# EAGLE design jayday_fez40 (EAGLE 6.3)
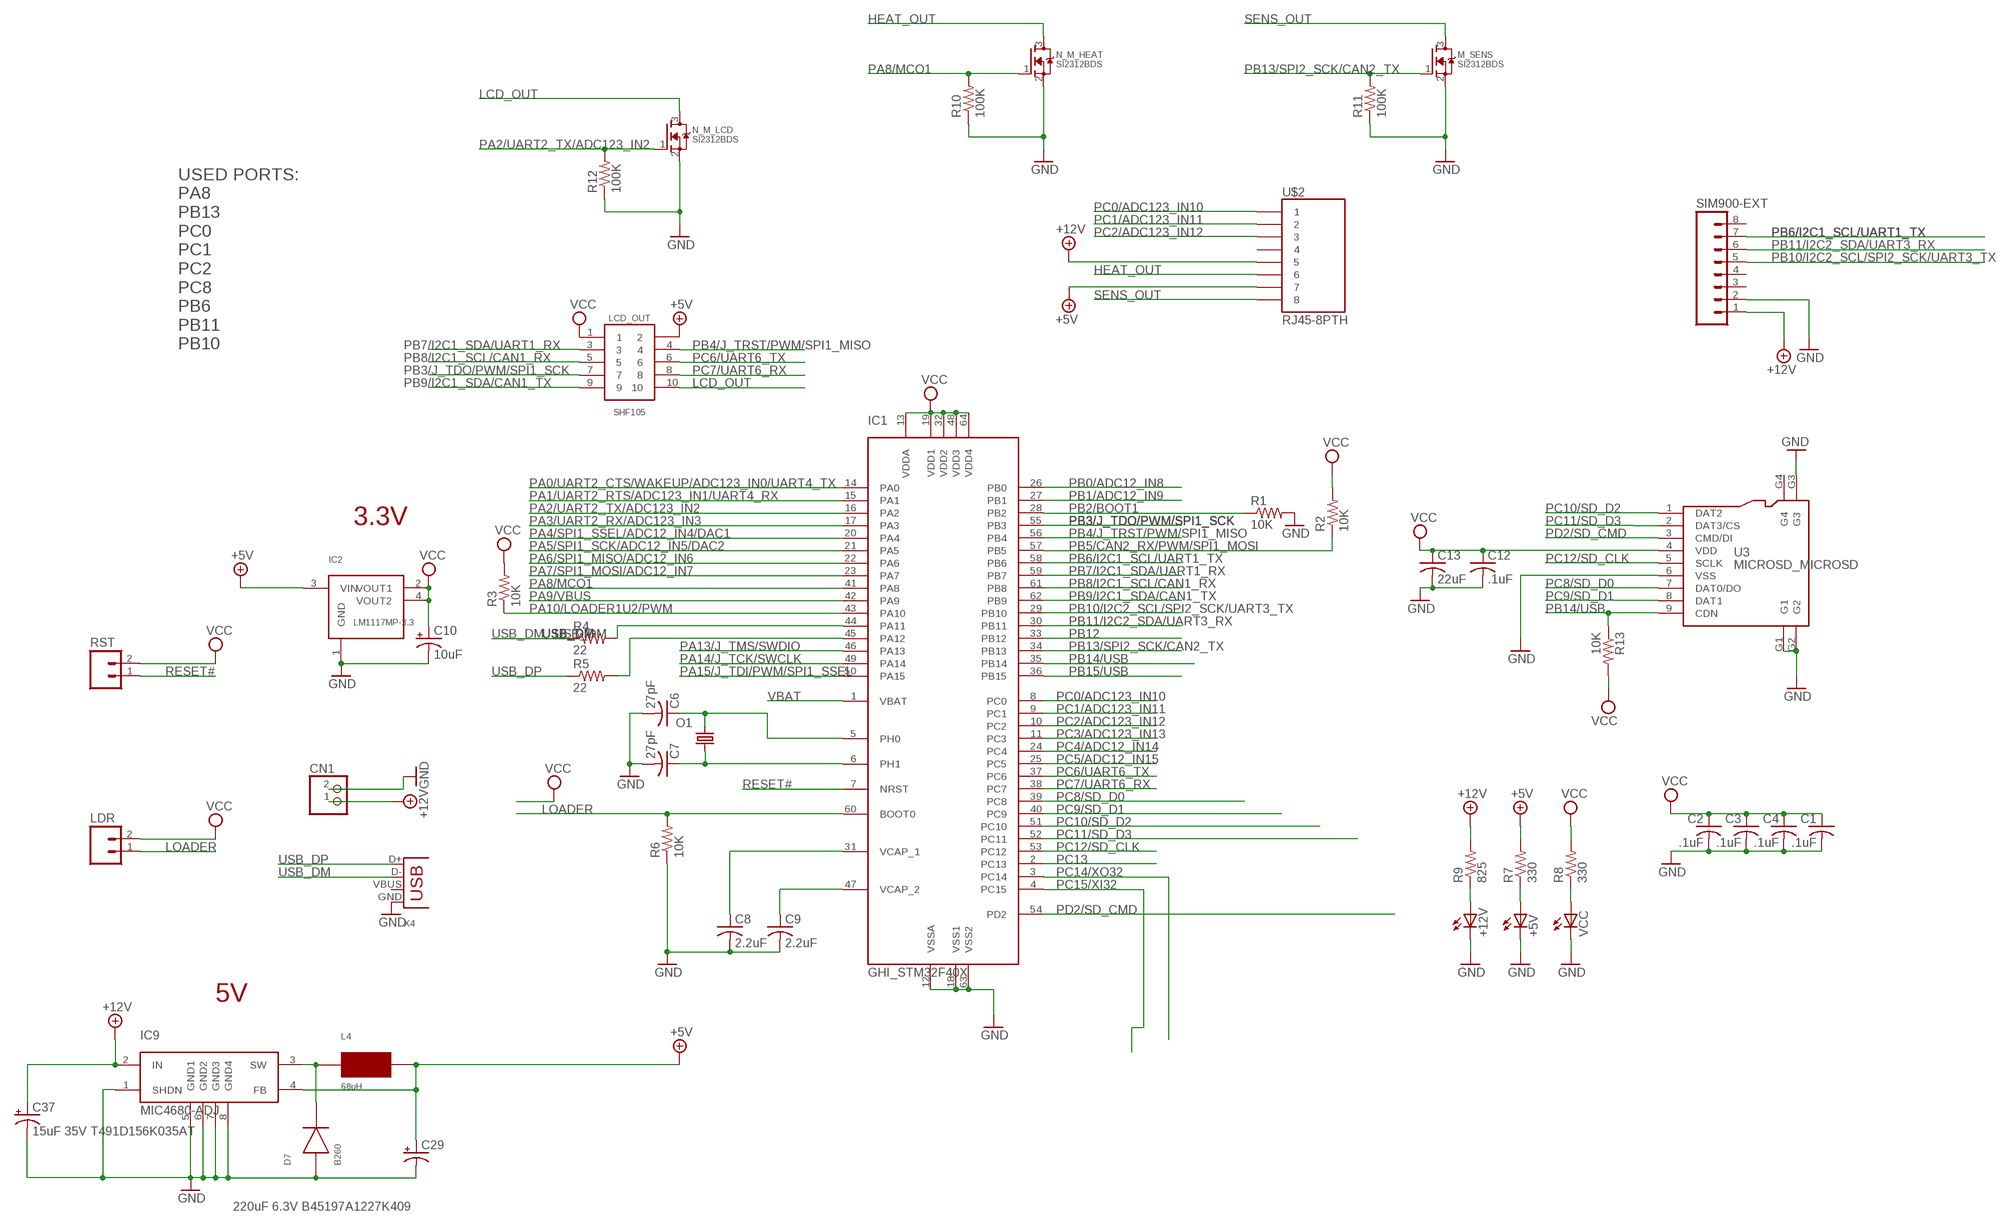
[diagram p0: schematic, sheet 1]

## Parts
+5V  LEDCHIPLED_0805  [CHIPLED_0805]
+12V  LEDCHIPLED_0805  [CHIPLED_0805]
C1  .1uF  C-USC0603K  [C0603K]
C2  .1uF  C-USC0603K  [C0603K]
C3  .1uF  C-USC0603K  [C0603K]
C4  .1uF  C-USC0603K  [C0603K]
C6  27pF  C-USC0603K  [C0603K]
C7  27pF  C-USC0603K  [C0603K]
C8  2.2uF  C-USC0805K  [C0805K]
C9  2.2uF  C-USC0805K  [C0805K]
C10  10uF  CPOL-USCT3528  [CT3528]
C12  .1uF  C-USC0603K  [C0603K]
C13  22uF  C-USC0805K  [C0805K]
C29  220uF 6.3V B45197A1227K409  CPOL-USD/7343-31W  [D/7343-31W]
C37  15uF 35V T491D156K035AT  CPOL-USD/7343-31W  [D/7343-31W]
CN1  JST_2PIN-THM-RA  [JST-PH-2-THM-RA]
D7  B260  DIODE_SMA  [DIODE_SMA]
IC1  GHI_STM32F40X  [GHI_LQFP64]
IC2  LM1117MP-3.3  LM1117  [SOT223]
IC9  MIC4680-ADJ  MIC4680  [SO8]
L4  68uH  UP2BXXX  [UP2BXXX]
LCD_OUT  SHF105  [GAD_PAC_SMD]
LDR  M02PTH  [1X02]
M_SENS  SI2312BDS  [TO-236]
N_M_HEAT  SI2312BDS  [TO-236]
N_M_LCD  SI2312BDS  [TO-236]
O1  12Mhz  CRYTALSM49  [SM49@1]
R1  10K  R-US_R0603  [R0603]
R2  10K  R-US_R0603  [R0603]
R3  10K  R-US_R0603  [R0603]
R4  22  R-US_R0603  [R0603]
R5  22  R-US_R0603  [R0603]
R6  10K  R-US_R0603  [R0603]
R7  330  R-US_R0603  [R0603]
R8  330  R-US_R0603  [R0603]
R9  825  R-US_R0603  [R0603]
R10  100K  R-US_R0603  [R0603]
R11  100K  R-US_R0603  [R0603]
R12  100K  R-US_R0603  [R0603]
R13  10K  R-US_R0603  [R0603]
RST  M02PTH  [1X02]
SIM900-EXT  M081X08  [1X08]
U3  MICROSD_MICROSD  [MICROSD_MICROSD]
U$2  RJ45-8PTH  [RJ45-8]
VCC  LEDCHIPLED_0805  [CHIPLED_0805]
X4  DX2R005HN2E700  USB-MB-S  [USB-MB-S]

## Nets
+5V: C29.+ IC2.3(VIN) IC9.4(FB) L4.P$2 LCD_OUT.2 R7.2 U$2.7
+12V: C37.+ CN1.1 IC9.2(IN) R9.2 SIM900-EXT.1 U$2.5
GND: +5V.C +12V.C C1.2 C2.2 C3.2 C4.2 C6.2 C7.2 C8.2 C9.2 C10.- C12.2 C13.2 C29.- C37.- CN1.2 D7.A IC1.12(VSSA) IC1.18(VSS1) IC1.63(VSS2) IC2.1(GND) IC9.1(SHDN) IC9.5(GND1) IC9.6(GND2) IC9.7(GND3) IC9.8(GND4) M_SENS.2(S) N_M_HEAT.2(S) N_M_LCD.2(S) R1.2 R6.1 R10.1 R11.1 R12.1 SIM900-EXT.2 U3.6(VSS) U3.G1 U3.G2 U3.G3 VCC.C X4.GND
HEAT_OUT: N_M_HEAT.3(D) U$2.6
LCD_OUT: LCD_OUT.10 N_M_LCD.3(D)
LOADER: IC1.60(BOOT0) LDR.1 R6.2
N$2: C9.1 IC1.47(VCAP_2)
N$3: C8.1 IC1.31(VCAP_1)
N$5: IC1.44(PA11) R4.2
N$7: IC1.45(PA12) R5.2
N$10: D7.K IC9.3(SW) L4.P$1
N$11: +5V.A R7.1
N$12: R8.1 VCC.A
N$13: +12V.A R9.1
PA0/UART2_CTS/WAKEUP/ADC123_IN0/UART4_TX: IC1.14(PA0)
PA1/UART2_RTS/ADC123_IN1/UART4_RX: IC1.15(PA1)
PA2/UART2_TX/ADC123_IN2: IC1.16(PA2) N_M_LCD.1(G) R12.2
PA3/UART2_RX/ADC123_IN3: IC1.17(PA3)
PA4/SPI1_SSEL/ADC12_IN4/DAC1: IC1.20(PA4)
PA5/SPI1_SCK/ADC12_IN5/DAC2: IC1.21(PA5)
PA6/SPI1_MISO/ADC12_IN6: IC1.22(PA6)
PA7/SPI1_MOSI/ADC12_IN7: IC1.23(PA7)
PA8/MCO1: IC1.41(PA8) N_M_HEAT.1(G) R10.2
PA9/VBUS: IC1.42(PA9)
PA10/LOADER1U2/PWM: IC1.43(PA10) R3.1
PA13/J_TMS/SWDIO: IC1.46(PA13)
PA14/J_TCK/SWCLK: IC1.49(PA14)
PA15/J_TDI/PWM/SPI1_SSEL: IC1.50(PA15)
PB0/ADC12_IN8: IC1.26(PB0)
PB1/ADC12_IN9: IC1.27(PB1)
PB2/BOOT1: IC1.28(PB2) R1.1
PB3/J_TDO/PWM/SPI1_SCK: IC1.55(PB3) LCD_OUT.7
PB4/J_TRST/PWM/SPI1_MISO: IC1.56(PB4) LCD_OUT.4
PB5/CAN2_RX/PWM/SPI1_MOSI: IC1.57(PB5) R2.1
PB6/I2C1_SCL/UART1_TX: IC1.58(PB6) SIM900-EXT.7
PB7/I2C1_SDA/UART1_RX: IC1.59(PB7) LCD_OUT.3
PB8/I2C1_SCL/CAN1_RX: IC1.61(PB8) LCD_OUT.5
PB9/I2C1_SDA/CAN1_TX: IC1.62(PB9) LCD_OUT.9
PB10/I2C2_SCL/SPI2_SCK/UART3_TX: IC1.29(PB10) SIM900-EXT.5
PB11/I2C2_SDA/UART3_RX: IC1.30(PB11) SIM900-EXT.6
PB12: IC1.33(PB12)
PB13/SPI2_SCK/CAN2_TX: IC1.34(PB13) M_SENS.1(G) R11.2
PB14/USB: IC1.35(PB14) R13.1 U3.9(CDN)
PB15/USB: IC1.36(PB15)
PC0/ADC123_IN10: IC1.8(PC0) U$2.1
PC1/ADC123_IN11: IC1.9(PC1) U$2.2
PC2/ADC123_IN12: IC1.10(PC2) U$2.3
PC3/ADC123_IN13: IC1.11(PC3)
PC4/ADC12_IN14: IC1.24(PC4)
PC5/ADC12_IN15: IC1.25(PC5)
PC6/UART6_TX: IC1.37(PC6) LCD_OUT.6
PC7/UART6_RX: IC1.38(PC7) LCD_OUT.8
PC8/SD_D0: IC1.39(PC8) U3.7(DAT0/DO)
PC9/SD_D1: IC1.40(PC9) U3.8(DAT1)
PC10/SD_D2: IC1.51(PC10) U3.1(DAT2)
PC11/SD_D3: IC1.52(PC11) U3.2(DAT3/CS)
PC12/SD_CLK: IC1.53(PC12) U3.5(SCLK)
PC13: IC1.2(PC13)
PC14/XO32: IC1.3(PC14)
PC15/XI32: IC1.4(PC15)
PD2/SD_CMD: IC1.54(PD2) U3.3(CMD/DI)
RESET#: IC1.7(NRST) RST.1
SENS_OUT: M_SENS.3(D) U$2.8
USB_DM: R4.1 X4.D-
USB_DP: R5.1 X4.D+
VBAT: IC1.1(VBAT)
VCC: C1.1 C2.1 C3.1 C4.1 C10.+ C12.1 C13.1 IC1.13(VDDA) IC1.19(VDD1) IC1.32(VDD2) IC1.48(VDD3) IC1.64(VDD4) IC2.2(VOUT1) IC2.4(VOUT2) LCD_OUT.1 LDR.2 R2.2 R3.2 R8.2 R13.2 RST.2 U3.4(VDD)
XTAL3: C6.1 IC1.5(PH0) O1.2
XTAL4: C7.1 IC1.6(PH1) O1.1
Unconnected: SIM900-EXT.3 SIM900-EXT.4 SIM900-EXT.8 U3.G4 U$2.4 X4.VBUS

## Notes on the sheet
- USED PORTS:
  PA8
  PB13
  PC0
  PC1
  PC2
  PC8
  PB6
  PB11
  PB10
- 3.3V
- 5V

## Library data of the parts
+5V +12V VCC = led:LED: LED OSRAM: - CHIPLED LG R971, LG N971, LY N971, LG Q971, LY Q971, LO R971, LY R971 LH N974, LH R974 LS Q976, LO Q976, LY Q976 LO Q996 - Hyper CHIPLED LW Q18S LB Q993, LB Q99A, LB R99A - SideLED LS A670, LO A670, LY A670, LG A670, LP A670 LB A673, LV A673, LT A673, LW A673 LH A674 LY A675 LS A676, LA A676, LO A676, LY A676, LW A676 LS A679, LY A679, LG A679 - Hyper Micro SIDELED® LS Y876, LA Y876, LO Y876, LY Y876 LT Y87S - SmartLED LW L88C, LW L88S LB L89C, LB L89S, LG L890 LS L89K, LO L89K, LY L89K LS L896, LA L896, LO L896, LY L896 - TOPLED LS T670, LO T670, LY T670, LG T670, LP T670 LSG T670, LSP T670, LSY T670, LOP T670, LYG T670 LG T671, LOG T671, LSG T671 LB T673, LV T673, LT T673, LW T673 LH T674 LS T676, LA T676, LO T676, LY T676, LB T676, LH T676, LSB T676, LW T676 LB T67C, LV T67C, LT T67C, LS T67K, LO T67K, LY T67K, LW E67C LS E67B, LA E67B, LO E67B, LY E67B, LB E67C, LV E67C, LT E67C LW T67C LS T679, LY T679, LG T679 LS T770, LO T770, LY T770, LG T770, LP T770 LB T773, LV T773, LT T773, LW T773 LH T774 LS E675, LA E675, LY E675, LS T675 LS T776, LA T776, LO T776, LY T776, LB T776 LHGB T686 LT T68C, LB T68C - Hyper Mini TOPLED® LB M676 - Mini TOPLED Santana® LG M470 LS M47K, LO M47K, LY M47K Source: http://www.osram.convergy.de LUXEON: - LUMILED® LXK2-PW12-R00, LXK2-PW12-S00, LXK2-PW14-U00, LXK2-PW14-V00 LXK2-PM12-R00, LXK2-PM12-S00, LXK2-PM14-U00 LXK2-PE12-Q00, LXK2-PE12-R00, LXK2-PE12-S00, LXK2-PE14-T00, LXK2-PE14-U00 LXK2-PB12-K00, LXK2-PB12-L00, LXK2-PB12-M00, LXK2-PB14-N00, LXK2-PB14-P00, LXK2-PB14-Q00 LXK2-PR12-L00, LXK2-PR12-M00, LXK2-PR14-Q00, LXK2-PR14-R00 LXK2-PD12-Q00, LXK2-PD12-R00, LXK2-PD12-S00 LXK2-PH12-R00, LXK2-PH12-S00 LXK2-PL12-P00, LXK2-PL12-Q00, LXK2-PL12-R00 Source: www.luxeon.com KINGBRIGHT: KA-3528ASYC Source: www.kingbright.com
C1-C4 C6-C9 C12 C13 = rcl:C-US: CAPACITOR, American symbol
C10 C29 C37 = rcl:CPOL-US: POLARIZED CAPACITOR, American symbol
CN1 = adafruit:JST_2PIN: JST 2-Pin Connectors of various flavors SMT-RA (S2B-PH-SM4) 4UConnector #17311 SMT (B2B-PH-SM4) THM-RA (S2B-PH) THM (B2B-PH)
D7 = GHI:DIODE_SMA
IC1 = FEZ_Cerb40:GHI_STM32F40X
IC2 = GHI:LM1117
IC9 = GHI:MIC4680
L4 = GHI:UP2BXXX
LCD_OUT = ozlollc:SHF105
LDR RST = SparkFun-Connectors:M02: Header 2 Standard 2-pin 0.1" header. Use with straight break away headers (SKU : PRT-00116), right angle break away headers (PRT-00553), swiss pins (PRT-00743), machine pins (PRT-00117), and female headers (PRT-00115). Molex polarized connector foot print use with SKU : PRT-08233 with associated crimp pins and housings.
M_SENS N_M_HEAT N_M_LCD = ozlollc:SI2312BDS
O1 = crystal:CRYTAL: CRYSTAL
R1-R13 = rcl:R-US_: RESISTOR, American symbol
SIM900-EXT = SparkFun-Connectors:M08: Header 8 Standard 8-pin 0.1" header. Use with straight break away headers (SKU : PRT-00116), right angle break away headers (PRT-00553), swiss pins (PRT-00743), machine pins (PRT-00117), and female headers (PRT-00115).
U3 = FEZ_Panda:MICROSD_MICROSD
U$2 = SparkFun-Connectors:RJ45-8: RJ45 Jack Simple RJ45, 8-pin connection - connector for common Cat5, Cat5e, and Cat6 Ethernet cables. Footprint not yet proven in production. Connector sku is PRT-00643; Breakout PCB sku is BOB-00716.
X4 = con-usb-3:USB: USB Connectors

## Board
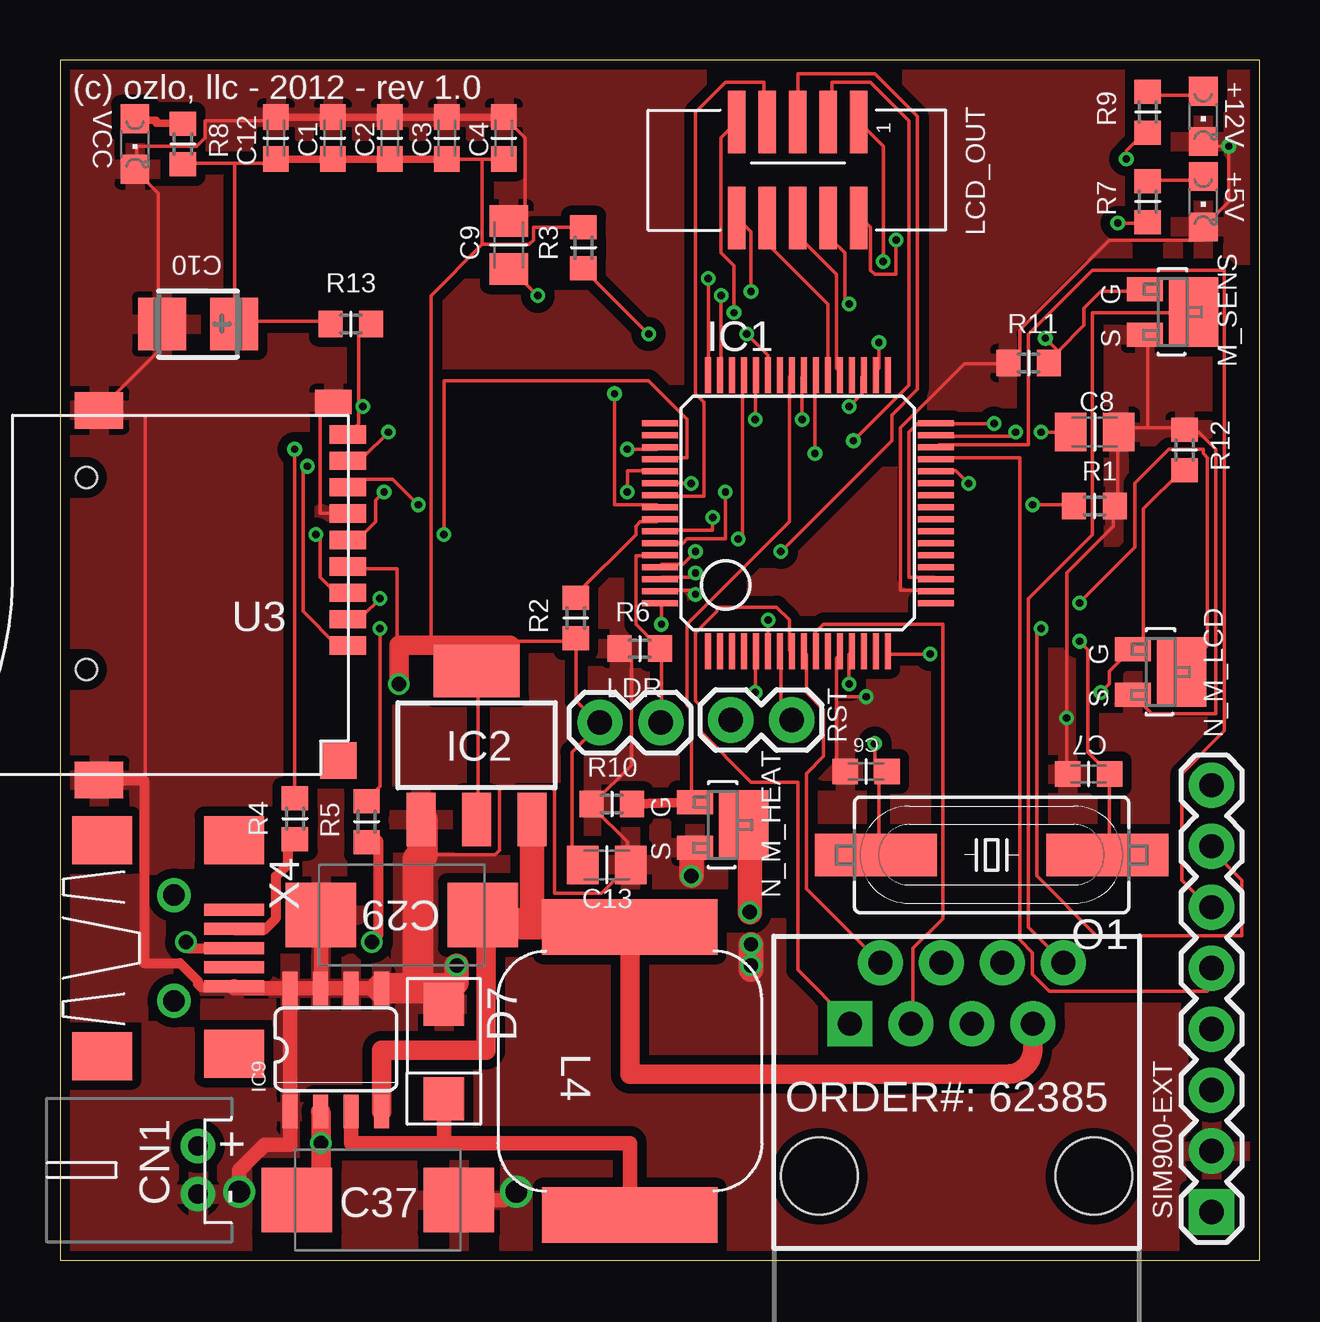
[diagram p1: board, top side]
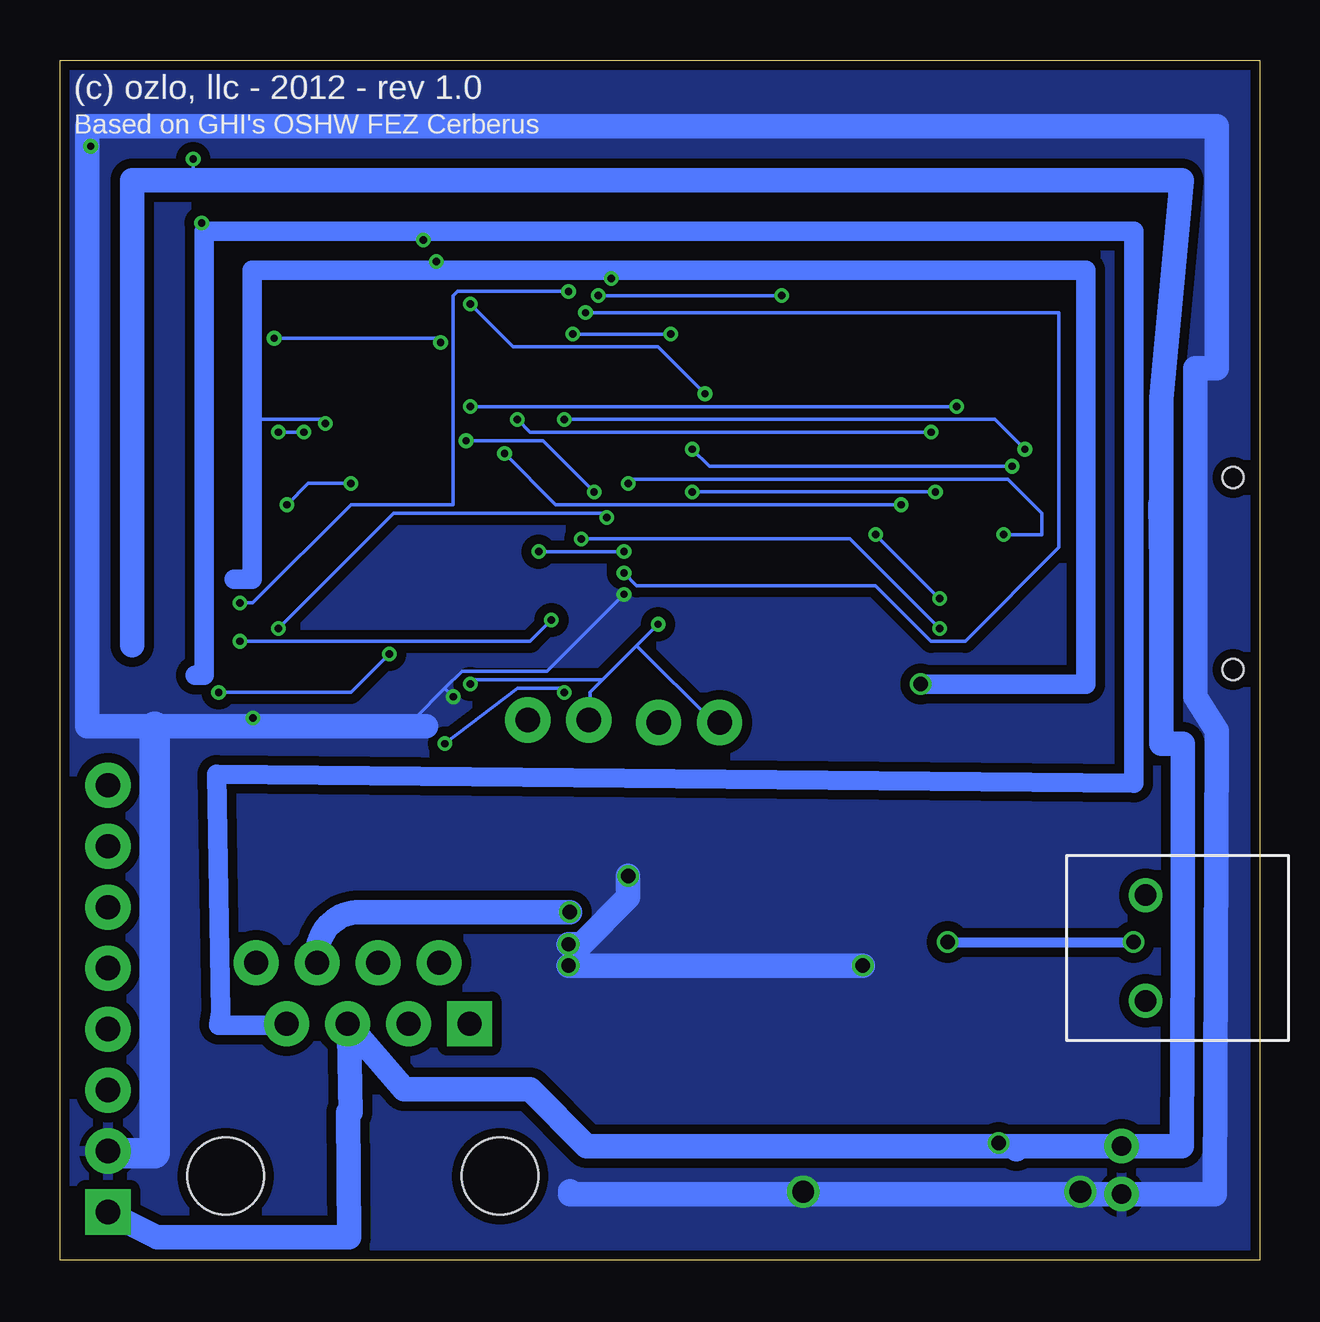
[diagram p2: board, bottom side, seen from below]

Size 50 x 50 mm. Coordinates in mm from the lower left corner, seen from the top.
Outline: 0,0 50,0 50,50 0,50 0,0
Copper layers (1*16): Top 0.035mm / dielectric 1.5mm / Bottom 0.035mm
Design rules "Fusion_eagle_rule_v1.1": minimum track width 6mil, minimum drill 12mil, track to track 6mil, track to pad 6mil, pad to pad 6mil, via to via 6mil, smd to smd 0mil, copper to edge 10mil, drill to drill 10mil, minimum pad ring 10mil, minimum via ring 6mil, stop-mask expansion 2mil, vias tented up to drill 100mil, thermal gap 10mil

### Footprints (pad centres in the part's own frame; a part is rotated, then mirrored left to right if it is on the bottom)
CHIPLED_0805 = smd 1.2 x 1.2: A 0,-1.05; C 0,1.05
C0603K = smd 1.05 x 1.08: 1 -0.875,0; 2 0.875,0
C0805K = smd 1.3 x 1.6: 1 -1,0; 2 1,0
CT3528 = smd 2 x 2.2: + 1.5,0; - -1.5,0
D/7343-31W = smd 2.95 x 2.7: + 3.375,0; - -3.375,0
JST-PH-2-THM-RA = drill 0.8 pad 1.422: 1 1,0; 2 -1,0
DIODE_SMA = smd 1.778 x 1.676: A -1.905,0; K 2.032,0
GHI_LQFP64 = smd 0.25 x 1.5: 1 -3.75,-5.75; 2 -3.25,-5.75; 3 -2.75,-5.75; 4 -2.25,-5.75; 5 -1.75,-5.75; 6 -1.25,-5.75; 7 -0.75,-5.75; 8 -0.25,-5.75; 9 0.25,-5.75; 10 0.75,-5.75; 11 1.25,-5.75; 12 1.75,-5.75; 13 2.25,-5.75; 14 2.75,-5.75; 15 3.25,-5.75; 16 3.75,-5.75; 33 3.75,5.75; 34 3.25,5.75; 35 2.75,5.75; 36 2.25,5.75; 37 1.75,5.75; 38 1.25,5.75; 39 0.75,5.75; 40 0.25,5.75; 41 -0.25,5.75; 42 -0.75,5.75; 43 -1.25,5.75; 44 -1.75,5.75; 45 -2.25,5.75; 46 -2.75,5.75; 47 -3.25,5.75; 48 -3.75,5.75 | smd 1.5 x 0.25: 17 5.75,-3.75; 18 5.75,-3.25; 19 5.75,-2.75; 20 5.75,-2.25; 21 5.75,-1.75; 22 5.75,-1.25; 23 5.75,-0.75; 24 5.75,-0.25; 25 5.75,0.25; 26 5.75,0.75; 27 5.75,1.25; 28 5.75,1.75; 29 5.75,2.25; 30 5.75,2.75; 31 5.75,3.25; 32 5.75,3.75; 49 -5.75,3.75; 50 -5.75,3.25; 51 -5.75,2.75; 52 -5.75,2.25; 53 -5.75,1.75; 54 -5.75,1.25; 55 -5.75,0.75; 56 -5.75,0.25; 57 -5.75,-0.25; 58 -5.75,-0.75; 59 -5.75,-1.25; 60 -5.75,-1.75; 61 -5.75,-2.25; 62 -5.75,-2.75; 63 -5.75,-3.25; 64 -5.75,-3.75
SOT223 = smd 1.219 x 2.235: 1 -2.311,-3.099; 2 0,-3.099; 3 2.311,-3.099 | smd 3.6 x 2.2: 4 0,3.099
SO8 = smd 0.635 x 1.397: 1 -1.905,-2.565; 2 -0.635,-2.565; 3 0.635,-2.565; 4 1.905,-2.565; 5 1.905,2.565; 6 0.635,2.565; 7 -0.635,2.565; 8 -1.905,2.565
UP2BXXX = smd 2.3 x 7.3: P$1 -6,0; P$2 6,0
GAD_PAC_SMD = smd 2.6 x 0.74: 1 -2,2.58; 2 2,2.58; 3 -2,1.31; 4 2,1.31; 5 -2,0.04; 6 2,0.04; 7 -2,-1.23; 8 2,-1.23; 9 -2,-2.5; 10 2,-2.5
1X02 = drill 1.016 pad 1.88: 1 0,0; 2 2.54,0
TO-236 = smd 1 x 1.5: 1 -0.95,-1.15; 2 0.95,-1.15 | smd 2.9 x 2.05: 3 0,0.875
SM49@1 = smd 5.08 x 1.778: 1 -4.826,0; 2 4.826,0
R0603 = smd 1 x 1.1: 1 -0.85,0; 2 0.85,0
1X08 = drill 1.016 pad 1.88 square: 1 0,0 | drill 1.016 pad 1.88: 2 2.54,0; 3 5.08,0; 4 7.62,0; 5 10.16,0; 6 12.7,0; 7 15.24,0; 8 17.78,0
MICROSD_MICROSD = smd 1.524 x 0.762: 1 0,4.4; 2 0,3.3; 3 0,2.2; 4 0,1.1; 5 0,0; 6 0,-1.1; 7 0,-2.2; 8 0,-3.3; 9 0,-4.4 | smd 1.524 x 1.016: G1 0.6,-5.746 | smd 2.032 x 1.524: G2 10.373,-5.4; G3 10.373,10 | smd 1.524 x 1.524: G4 0.392,9.181 | hole 0.889: 10.9,-2.6; 10.9,5.4
RJ45-8 = drill 1 pad 1.88 square: 1 -4.445,6.35 | drill 1 pad 1.88: 2 -3.175,8.89; 3 -1.905,6.35; 4 -0.635,8.89; 5 0.635,6.35; 6 1.905,8.89; 7 3.175,6.35; 8 4.445,8.89 | hole 3.2: -5.715,0; 5.715,0
USB-MB-S = smd 2.5 x 0.5: D+ 2.5,0; D- 2.5,0.8; GND 2.5,-1.6; ID 2.5,-0.8; VBUS 2.5,1.6 | smd 2.5 x 2: P$1 -3,-4.5; P$2 -3,4.5; P$3 2.5,-4.4; P$4 2.5,4.5 | drill 0.9: P$5 0,2.2; P$6 0,-2.2

### Placement (x,y rotation side)
+5V  47.65,44.09 180 top
+12V  47.65,47.65 180 top
C1  11.38,46.75 90 top
C2  13.75,46.75 90 top
C3  16.12,46.75 90 top
C4  18.5,46.75 90 top
C6  33.61,20.36 180 top
C7  42.88,20.25 180 top
C8  43.12,34.5 0 top
C9  18.7,42.29 90 top
C10  5.75,39 0 top
C12  9,46.75 90 top
C13  22.79,16.46 0 top
C29  14.25,14.38 0 top
C37  13.25,2.5 180 top
CN1  5.75,3.75 90 top
D7  16,8.75 270 top
IC1  30.75,31.12 0 top
IC2  17.37,21.45 0 top
IC9  11.5,8.75 0 top
L4  23.75,7.88 90 top
LCD_OUT  30.71,45.41 270 top
LDR  25.04,22.39 180 top
M_SENS  46.38,39.5 270 top
N_M_HEAT  27.62,18.12 270 top
N_M_LCD  45.88,24.5 270 top
O1  38.83,16.88 180 top
R1  43.12,31.41 0 top
R2  21.5,26.75 270 top
R3  21.82,42.18 90 top
R4  9.8,18.39 90 top
R5  12.78,18.26 90 top
R6  24.17,25.47 0 top
R7  45.34,44.09 270 top
R8  5.12,46.5 270 top
R9  45.34,47.83 270 top
R10  23,19 0 top
R11  40.38,37.38 0 top
R12  46.88,33.75 270 top
R13  12.12,39 180 top
RST  30.5,22.5 180 top
SIM900-EXT  48,2 90 top
U3  12,30 180 top
U$2  37.38,3.5 0 top
VCC  3.12,46.5 180 top
X4  4.75,13 0 top

### Tracks (layer width: path | path; a pad name or v marks a point on that pad's centre or on a via)
+5V  (via drill 0.3)
  Top 0.152: v44.09,43.2 45.16,43.2 R7.2 | v34.85,42.49 34.85,41.07 33.96,41.07 33.78,41.25 33.78,43.03 33.43,43.38 LCD_OUT.2
  Top 0.61: 17.75,14.38 C29.+ | 17.75,14.38 17.75,13.88 | 17.75,14.38 19.68,14.38
  Top 0.813: IC9.4 13.4,8.75 17.75,8.75 17.75,14.38 | L4.P$2 23.75,7.75 39.5,7.75 arc90 40.55,8.8 U$2.7
  Top 1.016: 17.75,13.88 L4.P$2 | 19.68,14.38 IC2.3
  Bottom 0.152: v44.09,43.2 44,42.88 | 40.54,9.78 U$2.7 | v34.85,42.49 34.85,42.88
  Bottom 0.813: 40.36,9.78 40.54,9.78 43.38,9.78 43.3,10.31 | 43.29,9.82 43.3,10.31 | 43.3,10.31 43.47,20.23 5.25,19.88 5.25,42.88 34.85,42.88 44,42.88 44,24.38 44.38,24.38
+12V  (via drill 0.3, 0.61)
  Top 0.152: v44.45,45.87 44.45,46.23 44.98,46.76 R9.2
  Top 0.813: IC9.2 10.88,6.12 v10.88,4.88 10.88,2.62 10.75,2.5 C37.+
  Bottom 0.152: 44.45,45 v44.45,45.87
  Bottom 0.813: v10.88,4.88 10.88,4.75
  Bottom 1.016: 10.13,4.75 5.88,4.75 CN1.1 3.25,4.75 3.2,12.98 3.2,21.51 4.09,21.51 4.09,29 | 10.13,4.75 10.88,4.75 28.04,4.75 30.4,7.11 35.65,7.11 U$2.5 37.95,9.35 37.89,6.15 37.99,6.15 37.95,0.94 45.95,0.96 47.96,1.96 SIM900-EXT.1 | 10.13,4.62 10.13,4.75 | 4.14,31.49 4.09,29 | 4.09,29 4.09,35.92 3.25,45 44.45,45 47,45 47,25.62
GND  (via drill 0.3, 0.6, 0.9)
  Top 0.152: 10.85,35.2 10.85,31.11 11.91,31.11 U3.6 | 10.85,35.2 11.38,35.74 U3.G1 | C9.2 18.85,43.38 19.38,43.92 19.38,46.76 18.67,47.47 C4.2 | C12.2 8.89,47.47 6.04,47.47 6.04,46.76 5.69,46.41 3.2,46.41 3.2,45.52 VCC.C 3.2,45.34 4.09,44.45 4.09,39.12 C10.- 4.09,38.94 4.09,37.87 1.78,35.56 U3.G2 1.78,35.38 1.78,35.2 3.56,35.2 | 3.56,35.2 10.85,35.2 | +12V.C 47.65,46.41 v48.72,46.41 48.72,44.09 47.83,43.2 +5V.C 47.65,42.49 43.74,42.49 40.01,38.76 40.01,37.87 39.65,37.52 R11.1 39.47,37.34 37.69,37.34 35.03,34.67 35.03,27.91 36.45,27.91 IC1.18 | C7.2 41.96,20.27 v41.96,22.58 41.96,28.63 43.92,30.58 43.92,31.29 R1.2 44.09,31.47 44.09,34.49 C8.2 44.27,34.67 45.34,34.67 | 45.34,34.67 46.76,34.67 R12.1 46.94,34.49 47.47,34.49 48.18,33.78 48.18,22.76 45.52,22.76 44.81,23.47 N_M_LCD.2 | 45.34,34.67 45.34,38.41 M_SENS.2 | 23.65,17.25 23.65,16.54 C13.2 | 23.65,17.25 23.65,17.42 22.23,18.85 R10.1 22.23,19.02 23.82,20.62 23.82,25.07 23.47,25.43 R6.1 | 26.31,17.25 N_M_HEAT.2 | 23.65,17.25 C13.2 | 32.36,23.47 32.36,25.07 32.54,25.25 IC1.12 | 32.36,23.47 32.36,20.09 C6.2 | 9.6,11.02 IC9.8 | v26.49,27.74 26.49,27.91 25.07,27.91 IC1.63 | 9.6,6.4 IC9.1 | v33.6,23.47 32.36,23.47 | 15.11,16.89 18.14,16.89 18.31,17.07 18.31,19.74 20.45,19.74 20.62,19.56 20.62,15.29 22.58,15.29 23.65,16.36 C13.2 | 3.56,35.2 3.56,20.09 3.5,20
  Top 0.305: C12.2 C1.2 C2.2 C3.2 C4.2
  Top 0.406: U3.G3 3.5,20 3.5,12.38 5,12.38 5.75,11.62 5.75,11.5 5.88,11.38 7.22,11.38 X4.GND
  Top 0.61: IC9.5 IC9.6 IC9.7 | IC9.7 IC9.8 7.25,11.31 X4.GND | C29.- 10.88,11.5 IC9.7 | IC9.1 9.6,6.04 9.6,4.8 8.53,4.8 7.47,3.73 v7.47,2.85 7.47,2.67 | C37.- 16.71,2.49 18.49,2.49 18.67,2.67 19.02,2.67 v19.02,2.85 | 9.6,6.22 9.6,6.4 9.6,11.02 9.6,11.38
  Top 1.016: v28.8,13.16 v28.8,12.27 28.8,12.09 | v26.31,16 26.31,17.07 N_M_HEAT.2 | v16.54,12.27 16.54,11.56 16,11.31
  Top 1.27: IC9.5 14.94,11.31 | 14.94,11.31 16,11.31 D7.A | 14.94,11.31 14.94,16.71 15.11,16.89 15.11,18.31 IC2.1
  Bottom 0.152: SIM900-EXT.2 48.01,4.62 48.01,4.45 | v26.49,27.74 29.69,24.54 33.25,24.54 33.96,23.82 | 33.96,23.82 35.2,22.58 35.2,22.25 | 33.96,23.82 v33.6,23.47 | 46.05,21.87 46.05,22.25 | v41.96,22.58 41.96,22.25 | v48.72,46.41 48.88,46.41
  Bottom 0.61: v7.47,2.85 7.47,2.75 | v19.02,2.85 19.02,2.75
  Bottom 1.016: 28.75,2.88 28.75,2.75 19.02,2.75 7.47,2.75 CN1.2 1.86,2.75 1.78,21.87 1.78,22.05 2.67,23.47 2.67,37.16 1.78,37.16 1.78,47.25 48.88,47.25 48.88,46.41 48.88,22.25 46.05,22.25 41.96,22.25 35.2,22.25 34.75,22.25 | v28.8,13.16 28.27,13.16 26.31,15.11 v26.31,16 | v16.54,12.27 v28.8,12.27
  Bottom 1.27: 46.05,22.23 46.05,21.87 46.05,4.45 48.01,4.45
  pour Bottom (isolate 0.4): 0,50 50,50 50,0 0,0
  pour Top (isolate 0.4): 0,50 50,50 50,0 0,0
HEAT_OUT  (via drill 0.61)
  Top 1.016: v28.75,14.5 28.75,17.25 28.5,17.5 28.5,18 N_M_HEAT.3
  Bottom 1.016: U$2.6 39.28,12.72 arc90 37.5,14.5 37,14.5 32.25,14.5 v28.75,14.5
LCD_OUT  (via drill 0.3)
  Top 0.152: v28.8,40.36 28.8,42.85 28.27,43.38 LCD_OUT.10 | v42.49,27.38 44.81,29.69 44.81,32.36 46.23,33.78 47.65,33.78 47.65,33.6 47.83,33.43 47.83,25.6 46.76,24.54 N_M_LCD.3
  Bottom 0.152: v28.8,40.36 33.43,40.36 33.6,40.18 33.6,31.47 37.87,31.47 41.96,27.38 v42.49,27.38
LOADER
  Top 0.152: LDR.1 25.07,22.4 25.07,25.43 R6.2 24.89,25.6 24,26.49 24,29.34 24.89,29.34 IC1.60
N$2  (via drill 0.3)
  Top 0.152: v27.56,40.18 27.56,36.98 IC1.47 | v19.91,40.18 18.85,41.25 C9.1
  Bottom 0.152: v19.91,40.18 v27.56,40.18
N$3  (via drill 0.3)
  Top 0.152: v39.83,34.49 39.83,34.31 36.63,34.31 IC1.31 | v40.89,34.49 41.96,34.49 C8.1
  Bottom 0.152: v40.89,34.49 v39.83,34.49
N$5  (via drill 0.3)
  Top 0.152: v9.78,33.78 9.78,19.38 R4.2 | v28.98,35.03 28.98,36.8 IC1.44
  Bottom 0.152: v9.78,33.78 11.02,35.03 v28.98,35.03
N$7  (via drill 0.3)
  Top 0.152: v13.34,26.31 13.34,19.74 12.8,19.2 R5.2 | v28.27,30.05 28.45,30.23 28.45,36.8 IC1.45
  Bottom 0.152: v13.34,26.31 17.07,30.05 v28.27,30.05
N$10
  Top 0.61: IC9.3 12.12,4.88 16,4.88 | 16,4.88 D7.K | L4.P$1 23.75,4.88 16,4.88
N$11
  Top 0.152: R7.1 45.34,44.98 47.65,44.98 +5V.A 47.65,45.16
N$12
  Top 0.305: R8.1 5.12,47.38 4,47.38 4,47.5 3.12,47.5 VCC.A
N$13
  Top 0.152: R9.1 45.16,48.54 47.47,48.54 +12V.A
PA2/UART2_TX/ADC123_IN2  (via drill 0.3)
  Top 0.152: R12.2 46.76,32.89 45.16,31.29 45.16,25.96 44.81,25.6 N_M_LCD.1 44.63,25.43 43.74,24.54 43.74,24 v43.38,23.65 | v36.27,25.25 34.49,25.25 IC1.16
  Bottom 0.152: v36.27,25.25 37.87,23.65 v43.38,23.65
PA8/MCO1
  Top 0.152: IC1.41 30.4,36.8 30.4,30.76 26.14,26.49 26.14,23.11 26.31,22.94 26.31,19.2 N_M_HEAT.1
  Top 0.406: N_M_HEAT.1 R10.2
PA10/LOADER1U2/PWM  (via drill 0.3)
  Top 0.152: v24.54,38.58 21.87,41.25 R3.1 | v28.63,38.58 29.52,37.69 29.52,36.98 IC1.43
  Bottom 0.152: v28.63,38.58 v24.54,38.58
PB2/BOOT1  (via drill 0.3)
  Top 0.152: v40.54,31.47 42.14,31.47 R1.1 | v37.87,32.36 37.34,32.89 36.63,32.89 IC1.28
  Bottom 0.152: v40.54,31.47 39.65,32.36 v37.87,32.36
PB3/J_TDO/PWM/SPI1_SCK
  Top 0.152: IC1.55 25.07,31.83 26.85,31.83 26.85,35.74 26.49,36.09 26.49,47.83 27.74,49.07 29.34,49.07 29.34,47.47 LCD_OUT.7
PB4/J_TRST/PWM/SPI1_MISO  (via drill 0.3)
  Top 0.152: v23.11,36.09 23.11,31.47 24.89,31.47 IC1.56 | v32.89,39.83 32.72,40.01 32.72,41.96 32.18,42.49 32.18,43.38 LCD_OUT.4
  Bottom 0.152: v23.11,36.09 25.07,38.05 31.11,38.05 v32.89,39.83
PB5/CAN2_RX/PWM/SPI1_MOSI
  Top 0.152: R2.1 21.51,27.74 24,30.23 24,30.58 24.18,30.76 24.89,30.76 IC1.57
PB6/I2C1_SCL/UART1_TX  (via drill 0.3)
  Top 0.152: v27.2,30.94 27.2,30.4 25.07,30.4 IC1.58 | v40.89,26.31 40.72,26.14 40.72,16 43.2,13.51 49.25,13.51 49.25,15.82 48.01,17.07 SIM900-EXT.7
  Bottom 0.152: v27.2,30.94 27.38,31.11 36.09,31.11 v40.89,26.31
PB7/I2C1_SDA/UART1_RX  (via drill 0.3)
  Top 0.152: v27.74,32 27.74,30.05 26.14,30.05 25.96,29.87 25.07,29.87 IC1.59 | v33.07,34.14 35.38,36.45 35.38,47.47 33.78,49.07 32.18,49.07 32.18,47.47 LCD_OUT.3
  Bottom 0.152: v27.74,32 29.87,34.14 v33.07,34.14
PB8/I2C1_SCL/CAN1_RX  (via drill 0.3)
  Top 0.152: v26.49,29.52 25.96,28.98 25.07,28.98 IC1.61 | v30.05,29.52 34.67,34.14 34.67,35.2 35.74,36.27 35.74,47.65 33.96,49.43 30.76,49.43 30.76,47.47 LCD_OUT.5
  Bottom 0.152: v30.05,29.52 v26.49,29.52
PB9/I2C1_SDA/CAN1_TX  (via drill 0.3)
  Top 0.152: v26.49,28.63 26.49,28.45 25.07,28.45 IC1.62 | v28.09,39.47 28.09,41.43 27.56,41.96 27.56,46.76 28.09,47.3 LCD_OUT.9
  Bottom 0.152: v26.49,28.63 25.96,28.09 16,28.09 13.69,25.78 12.27,25.78 8.36,29.69 8.36,39.47 v28.09,39.47
PB10/I2C2_SCL/SPI2_SCK/UART3_TX
  Top 0.152: IC1.29 36.63,33.43 40.01,33.43 40.01,13.34 40.54,12.8 40.54,11.91 41.25,11.2 47.83,11.2 47.83,12.09 SIM900-EXT.5
PB11/I2C2_SDA/UART3_RX
  Top 0.152: IC1.30 36.63,33.96 40.36,33.96 40.36,38.58 43.03,41.25 48.54,41.25 48.54,22.05 46.76,20.27 46.76,15.82 47.83,14.76 SIM900-EXT.6
PB13/SPI2_SCK/CAN2_TX  (via drill 0.3)
  Top 0.152: 41.6,37.87 42.67,38.94 42.67,39.65 43.38,40.36 45.16,40.36 M_SENS.1 | 41.6,37.87 41.25,37.52 R11.2 41.6,37.87 | v34.14,38.23 34.14,37.16 33.96,36.98 IC1.34 | 41.6,37.87 v41.07,38.41
  Bottom 0.152: v34.14,38.23 34.31,38.41 v41.07,38.41
PB14/USB  (via drill 0.3)
  Top 0.152: 12.45,35.56 12.45,34.85 12.09,34.49 U3.9 | 12.45,35.56 12.45,38.58 12.8,38.94 R13.1 | v32.89,35.56 33.43,36.09 33.43,36.8 IC1.35 | 12.45,35.56 v12.62,35.56
  Bottom 0.152: v12.62,35.56 v32.89,35.56
PC0/ADC123_IN10
  Top 0.152: IC1.8 30.4,25.43 30.4,26.67 29.87,27.2 27.38,27.2 27.38,27.03 26.49,26.14 26.49,23.29 26.67,23.11 26.67,22.05 28.8,19.91 30.76,19.91 30.76,12.09 32.89,9.96 U$2.1
PC1/ADC123_IN11
  Top 0.152: IC1.9 31.11,25.25 31.11,23.65 31.83,22.94 31.83,20.98 31.11,20.27 31.11,15.47 34.14,12.45 U$2.2
PC2/ADC123_IN12
  Top 0.152: IC1.10 31.47,25.43 31.47,26.14 31.83,26.49 36.8,26.49 36.8,14.22 35.56,12.98 35.56,9.96 U$2.3
PC6/UART6_TX
  Top 0.152: IC1.37 32.54,36.98 32.36,37.16 32.36,41.07 30.76,42.67 30.76,43.38 LCD_OUT.6
PC7/UART6_RX
  Top 0.152: IC1.38 32,36.98 32,39.83 29.52,42.32 29.52,43.38 LCD_OUT.8
PC8/SD_D0  (via drill 0.3)
  Top 0.152: v31.47,33.6 31.47,36.8 IC1.39 | v14.94,31.47 13.87,32.54 12.09,32.54 12.09,32.36 U3.7
  Bottom 0.152: v31.47,33.6 29.34,31.47 v14.94,31.47
PC9/SD_D1  (via drill 0.3)
  Top 0.152: v30.94,35.03 30.94,36.8 IC1.40 | v13.69,34.49 12.62,33.43 12.09,33.43 U3.8
  Bottom 0.152: v30.94,35.03 30.4,34.49 v13.69,34.49
PC10/SD_D2  (via drill 0.3)
  Top 0.152: v23.65,33.78 24.89,33.78 IC1.51 | v10.31,33.07 10.13,32.89 10.13,27.03 11.56,25.6 11.91,25.6 U3.1
  Bottom 0.152: v23.65,33.78 22.94,33.07 v10.31,33.07
PC11/SD_D3  (via drill 0.3)
  Top 0.152: v16,30.23 16,36.63 24.54,36.63 26.14,35.03 26.14,33.43 25.07,33.43 IC1.52 | v13.34,27.56 12.62,26.85 12.09,26.85 U3.2
  Bottom 0.152: v13.34,27.56 v16,30.23
PC12/SD_CLK  (via drill 0.3)
  Top 0.152: v23.65,32 23.65,32.89 24.89,32.89 IC1.53 | v13.51,32 13.16,31.65 13.16,30.76 12.45,30.05 12.09,30.05 U3.5
  Bottom 0.152: v13.51,32 v23.65,32
PD2/SD_CMD  (via drill 0.3)
  Top 0.152: v26.31,32.36 25.07,32.36 IC1.54 | v10.67,30.23 10.85,30.05 10.85,28.45 11.38,27.91 11.91,27.91 U3.3
  Bottom 0.152: v26.31,32.36 26.14,32.54 10.49,32.54 9.07,31.11 9.07,30.23 v10.67,30.23
RESET#
  Top 0.152: IC1.7 30.05,25.25 30.05,22.94 30.4,22.58 RST.1
SENS_OUT
  Top 0.152: M_SENS.3 47.12,39.47 43.03,39.47 43.03,30.23 40.36,27.56 40.36,13.87 41.78,12.45 U$2.8
USB_DM
  Top 0.406: R4.1 9.75,17.5 9.5,17.5 9.5,16.5 9,16 9,14.25 8.5,13.75 7.25,13.75 X4.D-
USB_DP  (via drill 0.61)
  Top 0.406: X4.D+ 5.25,13 v5.25,13.25 | v13,13.25 13.25,13.5 13.25,17.5 13,17.5 R5.1
  Bottom 0.406: v13,13.25 v5.25,13.25
VCC  (via drill 0.3, 0.6)
  Top 0.152: 7.29,39.12 11.2,39.12 R13.2 | 7.29,39.12 C10.+ 7.29,39.12 | 17.6,45.87 16.36,45.87 C3.1 | 17.6,45.87 C4.1 | 7.29,45.7 8.89,45.7 8.89,45.87 C12.1 | 7.29,45.7 5.16,45.7 R8.2 | 17.6,42.32 19.56,42.32 19.74,42.49 19.74,43.03 21.69,43.03 R3.2 | 17.6,45.87 17.6,42.32 | 7.29,45.7 7.29,39.12 | v25.07,26.49 25.07,27.38 IC1.64 | v32.89,24 32.89,25.25 IC1.13 | IC2.2 17.42,18.49 17.42,24.54 IC2.4 17.42,24.71 17.42,25.25 17.42,25.62 | C13.1 21.69,16.54 21.34,16.89 21.34,21.16 22.4,22.23 LDR.2 22.4,22.4 21.51,23.29 21.51,25.78 R2.2 21.34,25.78 19.02,25.78 18.75,25.62 | IC1.19 36.45,28.45 35.38,28.45 35.38,34.49 35.74,34.85 36.45,34.85 IC1.32 36.63,34.85 v38.94,34.85 | v27.03,40.89 27.03,36.98 IC1.48 | U3.4 12.09,28.8 14.05,28.8 14.05,25.96 14.12,25.62 | v34.31,41.6 34.31,46.41 33.43,47.3 LCD_OUT.1 | 17.6,42.32 15.47,40.18 15.47,25.96 15.47,25.62
  Top 0.305: C12.1 9.12,45.88 C1.1 11.5,45.88 C2.1 13.88,45.88 C3.1 16.25,45.88
  Top 0.813: v14.12,24 14.12,25.62 15.47,25.62 17.42,25.62 18.75,25.62
  Bottom 0.152: 27.38,24.18 27.91,23.65 27.91,22.58 RST.2 | 27.38,24.18 25.96,25.6 | 25.96,25.6 v25.07,26.49 | v32.89,24 32.72,24.18 27.38,24.18 | v27.03,40.89 27.03,41.25 | v34.31,41.6 34.31,41.25 | v38.94,34.85 39.12,35.03 41.6,35.03 42,35.03 | 25.96,25.6 22.76,22.4 22.58,22.4 LDR.2
  Bottom 0.813: v14.12,24 7.25,24 7.25,41.25 27.03,41.25 34.31,41.25 42,41.25 42,35.03 42,28.38 42.75,28.38
XTAL3  (via drill 0.3)
  Top 0.152: O1.2 34.14,16.89 34.14,19.91 C6.1 33.96,20.09 v33.96,21.51 | v28.98,23.65 28.98,25.25 IC1.5
  Bottom 0.152: v28.98,23.65 29.16,23.82 30.94,23.82 v33.96,21.51
XTAL4  (via drill 0.3)
  Top 0.152: O1.1 43.74,16.89 43.74,20.09 C7.1 43.74,20.27 42.85,21.16 42.85,25.43 v42.49,25.78 | v29.52,26.67 29.52,25.43 IC1.6
  Bottom 0.152: v29.52,26.67 30.4,25.78 v42.49,25.78

### Text on the board
tNames: (c) ozlo, llc - 2012 - rev 1.0 | ORDER#: 62385
bNames: (c) ozlo, llc - 2012 - rev 1.0 | Based on GHI's OSHW FEZ Cerberus